# Altium project Smart Battery.PrjPcb (part 2 of 2)

## Sheet 3S 4S.SchDoc
size A3; SheetNumber: 6; SheetTotal: 8
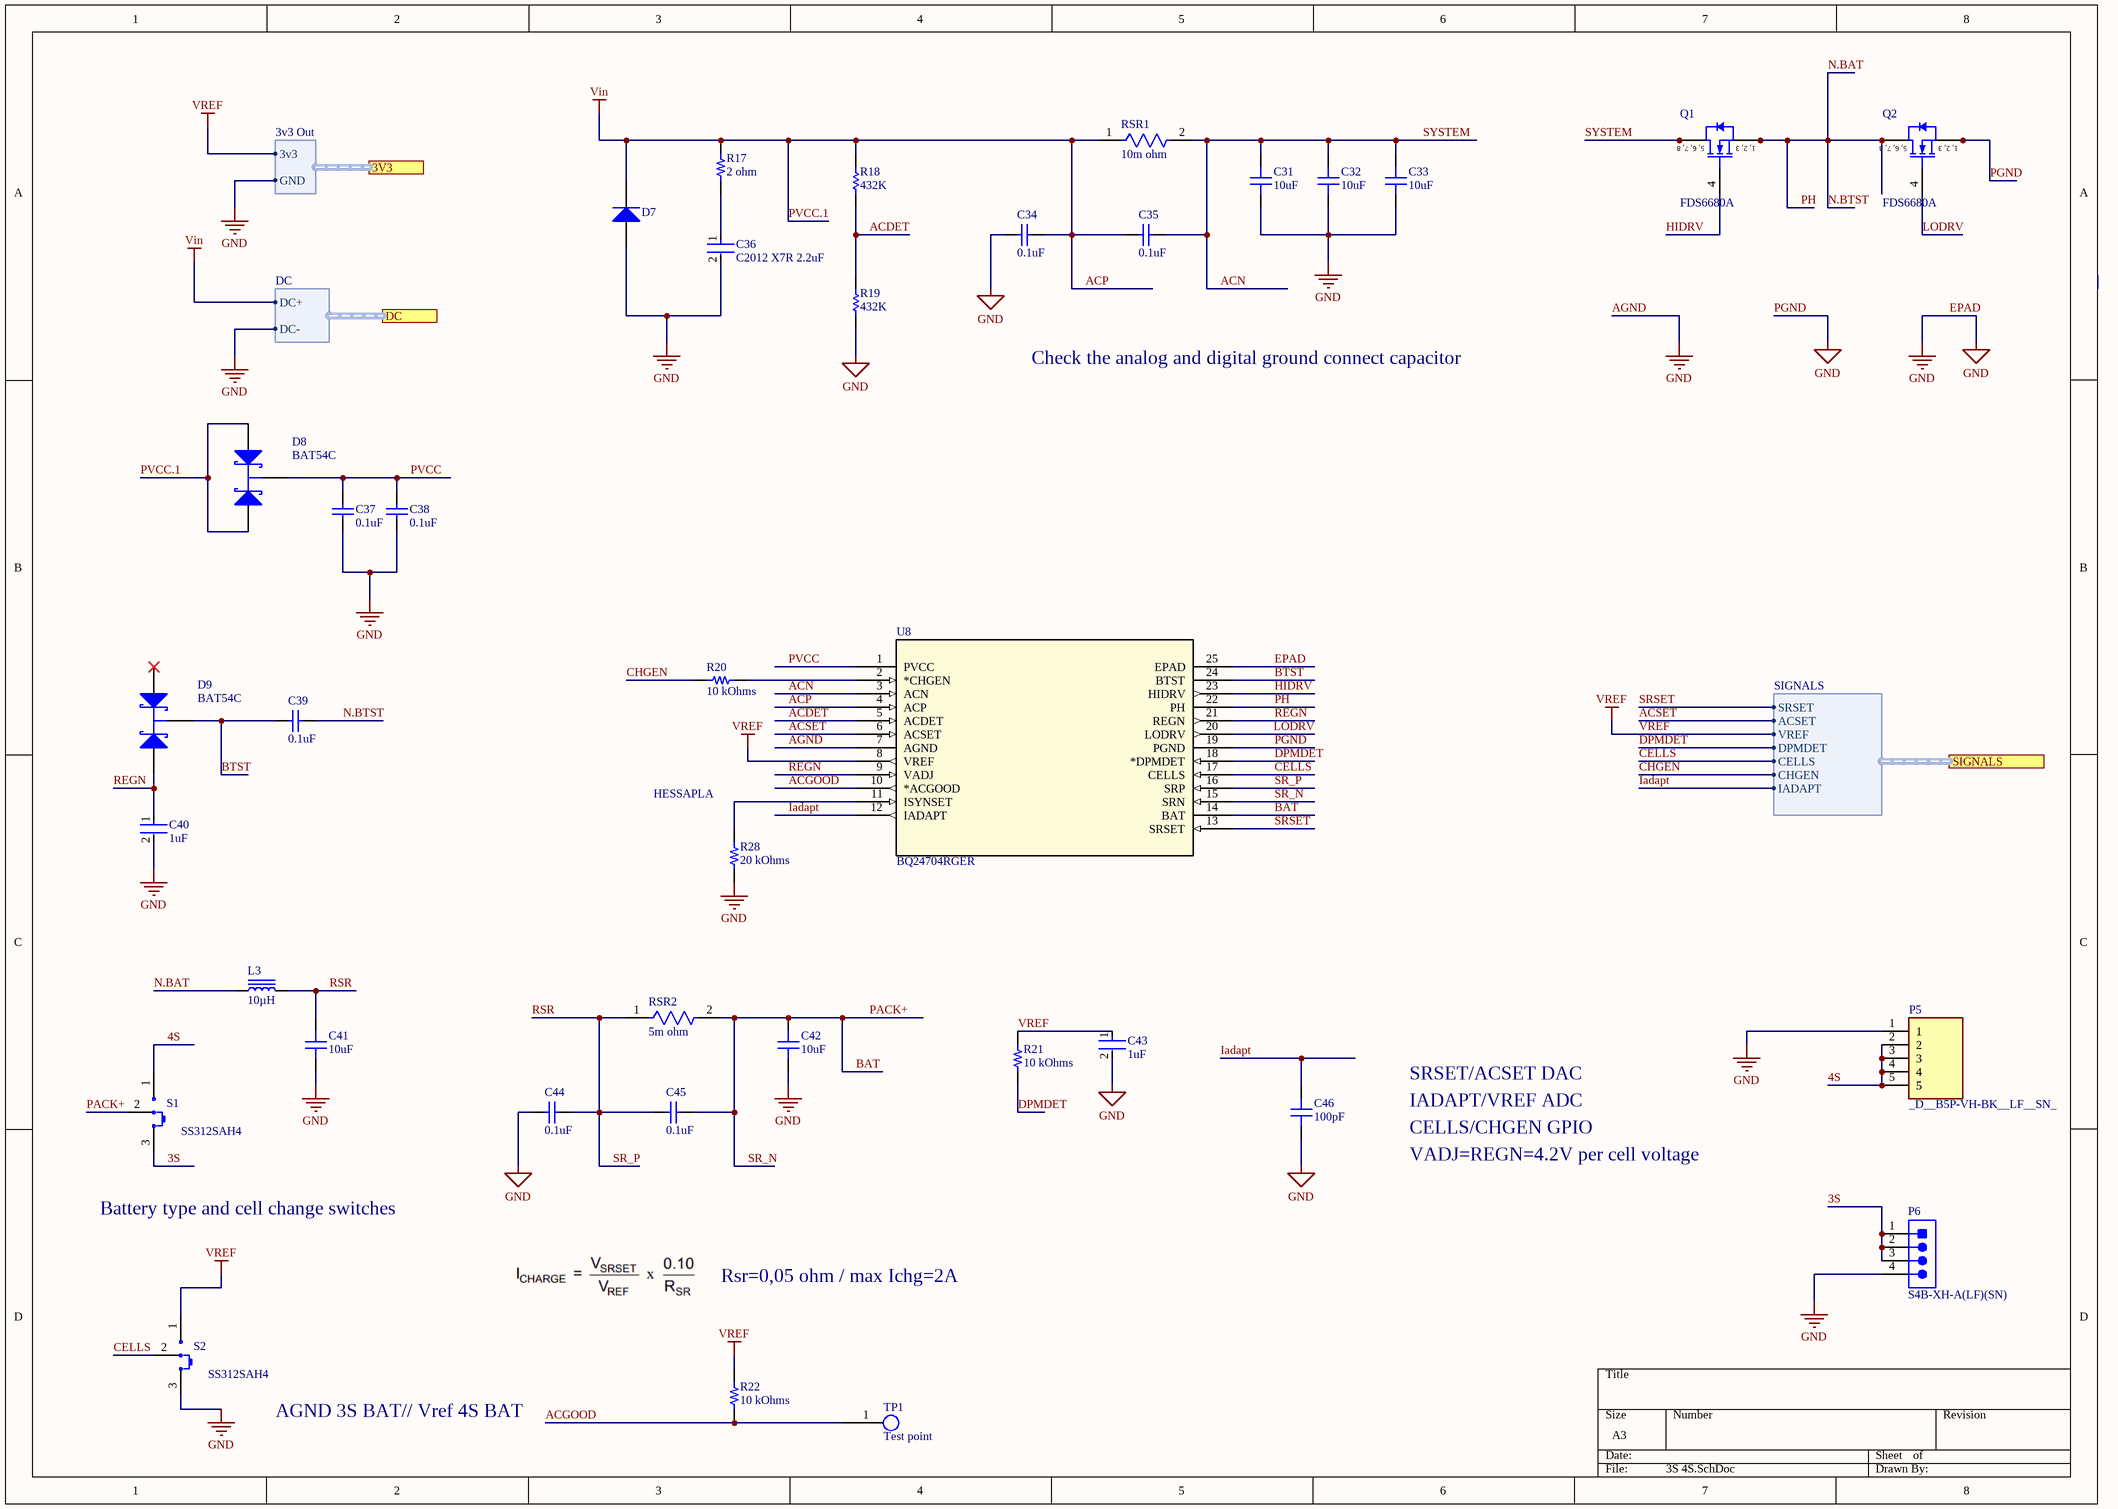
[diagram p5: 3S 4S.SchDoc]

### Parts
C31  10uF  [CAP 1206_3216 - 0.8MM]
C32  10uF  [CAP 1206_3216 - 0.8MM]
C33  10uF  [CAP 1206_3216 - 0.8MM]
C34  0.1uF  [CAPC2013X94X50NL20T25]
C35  0.1uF  [CAPC2013X94X50NL20T25]
C36  C2012 X7R 2.2uF  [FP-C2012-125-0_2-IPC_B]
C37  0.1uF  [CAPC2013X94X50NL20T25]
C38  0.1uF  [CAPC2013X94X50NL20T25]
C39  0.1uF  [CAPC2013X94X50NL20T25]
C40  1uF  [FP-C2012-125-0_2-IPC_B]
C41  10uF  [CAP 1206_3216 - 0.8MM]
C42  10uF  [CAP 1206_3216 - 0.8MM]
C43  1uF  [FP-C2012-125-0_2-IPC_B]
C44  0.1uF  [CAPC2013X94X50NL20T25]
C45  0.1uF  [CAPC2013X94X50NL20T25]
C46  100pF  [CAP 1206_3216 - 0.8MM]
D7  (no value)  [DIOD-SMA-2_A_V]
D8  BAT54C  [NXP-SOT23-3_V]
D9  BAT54C  [NXP-SOT23-3_V]
L3  10µH  [BOURNS SRP5030T]
P5  _D__B5P-VH-BK__LF__SN_  [SHDR5W114P0X396_1X5_1974X850X1090P]
P6  S4B-XH-A(LF)(SN)  [JST-S4B-XH-A(LF)(SN)_V]
Q1  FDS6680A  [FAIR-SOIC-8_V]
Q2  FDS6680A  [FAIR-SOIC-8_V]
R17  2 ohm  [RES 1210_3225]
R18  432K  [RESC1005X40X25NL05T10]
R19  432K  [RESC1005X40X25NL05T10]
R20  10 kOhms  [RES 0603_1608]
R21  10 kOhms  [RES 0603_1608]
R22  10 kOhms  [RES 0603_1608]
R28  20 kOhms  [RES 0603_1608]
RSR1  10m ohm  [FP-CSRN2010-IPC_A]
RSR2  5m ohm  [FP-CSRN2010-IPC_A]
S1  SS312SAH4  [NKK SS312SAH4]
S2  SS312SAH4  [NKK SS312SAH4]
TP1  Test point  [Test Point]
U8  BQ24704RGER  [RGE24_2P45X2P45]

### Ports
3V3 (harness 3v3 Out), DC (harness DC), SIGNALS (harness SIGNALS)

### Harnesses
SIGNALS: SRSET, ACSET, VREF, DPMDET, CELLS, CHGEN, IADAPT
3v3 Out: 3v3, GND
DC: DC+, DC-

### Nets
ACP: C34.2 C35.1 D7.2(K) D8.1(A) D8.2(A) R17.2 R18.2 RSR1.1 U8.4(ACP) ; port DC.DC+  [also labelled PVCC.1, Vin]
AGND: C31.1 C32.1 C33.1 C34.1 C36.2 C37.1 C38.1 C40.2 C41.1 C42.1 C43.2 C44.1 C46.1 D7.1(A) P5.1 P6.4 Q2.1(S) Q2.2(S) Q2.3(S) R19.1 R28.1 S2.3 U8.7(AGND) U8.19(PGND) U8.25(EPAD) ; port 3V3.GND, port DC.DC-  [also labelled EPAD, GND, PGND]
VREF: C43.1 R21.2 R22.2 S2.1 U8.8(VREF) ; port SIGNALS.VREF, port 3V3.3v3  [project net Power Input 3V3]
3S: P6.1 P6.2 P6.3 S1.3
4S: P5.2 P5.3 P5.4 P5.5 S1.1
ACDET: R18.1 R19.2 U8.5(ACDET)
ACGOOD: R22.1 TP1.1 U8.10(*ACGOOD)
ACN: C31.2 C32.2 C33.2 C35.2 Q1.5(D) Q1.6(D) Q1.7(D) Q1.8(D) RSR1.2 U8.3(ACN)  [also labelled SYSTEM]
ACSET: U8.6(ACSET) ; port SIGNALS.ACSET
BAT: C42.2 C45.2 RSR2.2 S1.2(COM) U8.14(BAT) U8.15(SRN)  [also labelled PACK+, SR_N]
BTST: C39.1 D9.3(K) U8.24(BTST)
CELLS: S2.2(COM) U8.17(CELLS) ; port SIGNALS.CELLS
CHGEN: R20.2 ; port SIGNALS.CHGEN
DPMDET: R21.1 U8.18(*DPMDET) ; port SIGNALS.DPMDET
HIDRV: Q1.4(G) U8.23(HIDRV)
IADAPT: C46.2 U8.12(IADAPT) ; port SIGNALS.IADAPT
LODRV: Q2.4(G) U8.20(LODRV)
N.BAT: C39.2 L3.1 Q1.1(S) Q1.2(S) Q1.3(S) Q2.5(D) Q2.6(D) Q2.7(D) Q2.8(D) U8.22(PH)  [also labelled N.BTST, PH]
PVCC: C37.2 C38.2 D8.3(K) U8.1(PVCC)
REGN: C40.1 D9.2(A) U8.9(VADJ) U8.21(REGN)
RSR: C41.2 C44.2 C45.1 L3.2 RSR2.1 U8.16(SRP)  [also labelled SR_P]
SRSET: U8.13(SRSET) ; port SIGNALS.SRSET
NetC36_1: C36.1 R17.1
NetR20_1: R20.1 U8.2(*CHGEN)
NetR28_2: R28.2 U8.11(ISYNSET)

Not connected (* = marked no-connect by the designer): D9 1(A)*

### Notes on the sheet
- Check the analog and digital ground connect capacitor
- (near R28) HESSAPLA
- SRSET/ACSET DAC
- IADAPT/VREF ADC
- CELLS/CHGEN GPIO
- VADJ=REGN=4.2V per cell voltage
- Battery type and cell change switches
- Rsr=0,05 ohm / max Ichg=2A
- AGND 3S BAT// Vref 4S BAT
- (in symbol CMP-2000-06259-1) 5, 6, 7, 8; 1, 2, 3

### Library data of the parts
C31-C33 C41 C42 = CC1206JRNPO0BN272: 10µF, 25V, 20%, X5R, 1206; Manufacturer: Yageo; Capacitance: 2700pF; Temperature Coefficient: C0G, NP0; Tolerance: ±5%; Voltage - Rated: 100V; Part Number: CC1206JRNPO0BN272; Value: 10uF; Applications: General Purpose; ComponentLink1Description: Datasheet; ComponentLink1URL: http://www.yageo.com/documents/recent/UPY-NP0X7R_MV_100-to-630V_21.pdf; ComponentLink2Description: DigiKey Link; ComponentLink2URL: http://digikey.com/product-detail/en/yageo/CC1206JRNPO0BN272/311-4396-1-ND/8025485; Device Package: 1206 (3216 Metric); LastUpdated: 2.09.2020 01:04:46; Lifecycle Status: Active; Minimum Order: 1; Mounting Type: Surface Mount, MLCC; Operating Temperature: -55°C ~ 125°C; Package / Case: 1206 (3216 Metric); Packaging: TapeAndReel; PartId: 18687; Part Status: Active; Price: 0.08; Series: CC; Size / Dimension: 0.126" L x 0.063" W (3.20mm x 1.60mm); Supplier 1: DigiKey; Supplier Part Number 1: 311-4396-1-ND; Thickness (Max): 0.028" (0.70mm)
C34 C35 C37-C39 C44 C45 = CMP-1036-04427-2: 0.1µF, 50V, 10%, X7R, 0805; Manufacturer: AVX Interconnect / Elco; Part Number: 08051C104JAT2A
C36 = CMP-2000-06040-2: Multilayer Ceramic Capacitors 2.2μF ±10% 50V X7R SMD 0805; Mount: Surface Mount; Dielectric Material: Ceramic; Height: 1.25mm; Radiation Hardening: No; Case/Package: 0805; Voltage: 50V; Min Operating Temperature: -55°C; Voltage Rating (DC): 50V; Lead Free: Lead Free; Length: 2mm; Dielectric: X7R; Package Quantity: 1; Contact Plating: Tin; RoHS Compliant: Yes; Series: C; Resistor Type: Ceramic; Voltage Rating: 50V; Case Code (Imperial): 0805; Thickness: 0.057inch; Packaging: Tape and Reel; Depth: 1.25mm; Max Operating Temperature: 125°C; Weight: 0.000194oz; Width: 0.049inch; Tolerance: 10%; Termination: SMD/SMT; Construction: Flat; Capacitance: 2.2uF; REACH SVHC: No SVHC; Case Code (Metric): 2012
C40 C43 = CMP-2000-05454-2: 1µF, 25V, 10%, X7R, 2012, TDK; Dielectric: X7S; Voltage Rating (DC): 100V; Case Code (Metric): 2012; Capacitance: 1uF; Width: 1.25mm; Mount: Surface Mount; Package Quantity: 1; RoHS Compliant: Yes; Case Code (Imperial): 0805; REACH SVHC: No SVHC; Resistor Type: Ceramic; Depth: 1.25mm; Thickness: 0.053inch; Case/Package: 0805; Lead Free: Lead Free; Length: 2mm; Series: C; Voltage: 100V; Height: 1.25mm; Min Operating Temperature: -55°C; Termination: SMD/SMT; Weight: 0.000194oz; Max Operating Temperature: 125°C; Number of Pins: 2; Tolerance: 10%; Packaging: Tape and Reel; Voltage Rating: 100V
C46 = CC1206JRNPO0BN272: 100pF, 25V, 10%, X7R, 0805,; Manufacturer: Yageo; Capacitance: 2700pF; Temperature Coefficient: C0G, NP0; Tolerance: ±5%; Voltage - Rated: 100V; Part Number: CC1206JRNPO0BN272; Value: 100pF; Applications: General Purpose; ComponentLink1Description: Datasheet; ComponentLink1URL: http://www.yageo.com/documents/recent/UPY-NP0X7R_MV_100-to-630V_21.pdf; ComponentLink2Description: DigiKey Link; ComponentLink2URL: http://digikey.com/product-detail/en/yageo/CC1206JRNPO0BN272/311-4396-1-ND/8025485; Device Package: 1206 (3216 Metric); LastUpdated: 2.09.2020 01:04:46; Lifecycle Status: Active; Minimum Order: 1; Mounting Type: Surface Mount, MLCC; Operating Temperature: -55°C ~ 125°C; Package / Case: 1206 (3216 Metric); Packaging: TapeAndReel; PartId: 18687; Part Status: Active; Price: 0.08; Series: CC; Size / Dimension: 0.126" L x 0.063" W (3.20mm x 1.60mm); Supplier 1: DigiKey; Supplier Part Number 1: 311-4396-1-ND; Thickness (Max): 0.028" (0.70mm)
D7 = CMP-2000-07364-1: Ultra-Fast Rectifier, 1 A, 1.7 V, -65 to 150 degC, 2-Pin SMA, RoHS, Tape and Reel; Manufacturer: Diodes Inc; Forward Voltage: 1.7V; Reverse Recovery Time-Max: 75ns; Average Rectified Current-Max: 1A; Reverse Current-Max: 5µA; Reverse Voltage-Max [Vrrm]: 1000V; Package Description: 2-Pin Surface Mount Device, Body 4.3 x 2.605 mm; Datasheet URL: http://www.diodes.com/_files/datasheets/ds16008.pdf; Datasheet Version: Rev. 11-2, 12/2014; Package Reference: SMA-2; Mounting Technology: SurfaceMount; Manufacturer URL: http://www.diodes.com/
D8 D9 = CMP-0417-00003-1: Schottky Barrier Diode, 30 V, 2 uA, -55 to 150 degC, 3-Pin SOT23, RoHS, Tape and Reel; Manufacturer: NXP Semiconductors; IR (uA): 2; VF (mV): 800; Trr (ns): 5; Cd (pF): 10; VR (V): 30; Rth(j-a) (K/W): 500; RoHS: TRUE; Packing: Tape and Reel; ComponentLink2URL: http://www.nxp.com/documents/data_sheet/BAT54_SER.pdf; PartNumber: BAT54C; ComponentLink2Description: Datasheet; Temperature Range: -55 to 150 degC; PackageReference: SOT23-3; PackageDescription: 3-Pin Plastic Surface-mounted Package, Body 1.3 x 2.9 mm, Pitch 0.95 mm; Mounting Technology: Surface Mount; ComponentLink1URL: http://www.nxp.com/; DatasheetVersion: Rev. 5; ComponentLink1Description: Manufacturer URL
L3 = SRP5030T-100M: FIXED IND 10UH 2.75A 128MOHM SMD; Manufacturer: Bourns Inc.; Current - Saturation: 3.5A; DC Resistance (DCR): 128mOhm Max; Inductance Frequency - Test: 100kHz; Material - Core: Iron Powder; Shielding: Shielded; Tolerance: ±20%; Type: Wirewound; Part Number: SRP5030T-100M; ComponentLink1Description: Datasheet; ComponentLink1URL: https://www.bourns.com/docs/Product-Datasheets/SRP5030T.pdf; ComponentLink2Description: DigiKey Link; ComponentLink2URL: http://digikey.com/product-detail/en/bourns-inc/SRP5030T-100M/SRP5030T-100MCT-ND/3986029; Current Rating (Amps): 2.75A; Device Package: Nonstandard; Height - Seated (Max): 0.118" (3.00mm); Inductance: 10µH; LastUpdated: 2.09.2020 01:22:09; Lifecycle Status: Active; Minimum Order: 1; Mounting Type: Surface Mount; Operating Temperature: -40°C ~ 125°C; Package / Case: Nonstandard; Packaging: TapeAndReel; PartId: 9; Part Status: Active; Price: 0.66; Series: SRP5030T; Size / Dimension: 0.224" L x 0.205" W (5.70mm x 5.20mm); Supplier 1: DigiKey; Supplier Part Number 1: SRP5030T-100MCT-ND; Value: 10µH
P5 = _D__B5P-VH-BK__LF__SN_: Connector; Manufacturer_Name: JST (JAPAN SOLDERLESS TERMINALS); Manufacturer_Part_Number: (D) B5P-VH-BK (LF)(SN); Datasheet Link: https://www.jst-mfg.com/product/pdf/eng/eVH.pdf; Height: 10.9mm; Mouser Part Number: N/A; Mouser Price/Stock: https://www.mouser.co.uk/ProductDetail/JST/D-B5P-VH-BK-LFSN?qs=wnTfsH77Xs6D1q6ZybO7cA%3D%3D
P6 = CMP-1755-00007-1: Male Header, Pitch 2.5 mm, 1 x 4 Position, Height 6.1 mm, Tail Length 3.4 mm, -25 to 85 degC, RoHS, Bulk; PackageReference: S4B-XH-A(LF)(SN); ComponentLink1Description: Manufacturer URL; DatasheetVersion: May-16; ComponentLink2Description: Datasheet; ComponentLink2URL: http://www.jst-mfg.com/product/pdf/eng/eXH.pdf; ComponentLink1URL: http://www.jst.com/home2.html; PackageDescription: Male Header, Pitch 2.5 mm, 1 x 4 Position, Height 6.1 mm, Tail Length 3.4 mm
Q1 Q2 = CMP-2000-06259-1: Single N-Channel, Logic Level, Power Trench(R) MOSFET, 30 V, 12.5 A, -55 to 150 degC, 8-Pin SOIC, RoHS, Tape and Reel; Manufacturer: Fairchild Semiconductor; Drain-to-Source Voltage [Vdss]: 30V; Drain-Source On Resistance-Max: 9.5mO; Rated Power Dissipation: 1W; Qg Gate Charge: 23nC; Package Description: 8-Pin Small Outline Integrated Circuit, Body 4.9 x 3.9 mm, Pitch 1.27 mm; Channel Type: N-Channel; Package Reference: SOIC-8; Datasheet Version: Rev. F2(W), 07/2012; Package URL: https://www.fairchildsemi.com/package-drawings/M0/M08A.pdf; Mounting Technology: SurfaceMount; Manufacturer URL: https://www.fairchildsemi.com/; Datasheet URL: https://www.fairchildsemi.com/datasheets/FD/FDS6680A.pdf
R17 = RK73B2ETTD332J: RES 3.3K OHM 5% 1/2W 1210; Manufacturer: KOA Speer Electronics, Inc.; Power (Watts): 0.5W, 1/2W; Resistance: 3.3 kOhms; Temperature Coefficient: ±200ppm/°C; Value: 3.3 kOhms; Part Number: RK73B2ETTD332J; ComponentLink1Description: Datasheet; ComponentLink1URL: http://www.koaspeer.com/catimages/Products/RK73B/RK73B.pdf; ComponentLink2Description: DigiKey Link; ComponentLink2URL: http://digikey.com/product-detail/en/koa-speer-electronics-inc/RK73B2ETTD332J/2019-RK73B2ETTD332JCT-ND/10315047; Composition: Thick Film; Device Package: 1210 (3225 Metric); Features: Automotive AEC-Q200, Moisture Resistant; LastUpdated: 2.09.2020 01:26:16; Lifecycle Status: Active; Minimum Order: 1; Number of Terminations: 2; Operating Temperature: -55°C ~ 155°C; Package / Case: 1210 (3225 Metric); Packaging: TapeAndReel; Part Status: Active; Price: 0.02; Ratings: AEC-Q200; Series: RK73B; Supplier 1: DigiKey; Supplier Part Number 1: 2019-RK73B2ETTD332JCT-ND; Supplier Device Package: 1210; Tolerance: ±5%
R18 R19 = CMP-1011-00001-2: 432K,1/16W, %1; Manufacturer: Yageo / Phycomp; Part Number: RC0402JR-070RL
R20-R22 = RNCS0603BKE10K0: RES 10K OHM 0.1% 1/16W 0603; Manufacturer: Stackpole Electronics Inc; Power (Watts): 0.063W, 1/16W; Temperature Coefficient: ±25ppm/°C; Part Number: RNCS0603BKE10K0; Value: 10 kOhms; ComponentLink1Description: Datasheet; ComponentLink1URL: https://www.seielect.com/catalog/sei-rncs_rnch.pdf; ComponentLink2Description: DigiKey Link; ComponentLink2URL: http://digikey.com/product-detail/en/stackpole-electronics-inc/RNCS0603BKE10K0/RNCS0603BKE10K0CT-ND/1800113; Composition: Thin Film; Device Package: 0603 (1608 Metric); Features: Anti-Corrosive, Automotive AEC-Q200, Moisture Resistant; Height - Seated (Max): 0.022" (0.55mm); LastUpdated: 2.09.2020 01:10:25; Lifecycle Status: Active; Minimum Order: 1; Number of Terminations: 2; Operating Temperature: -55°C ~ 155°C; Package / Case: 0603 (1608 Metric); Packaging: TapeAndReel; PartId: 4838; Part Status: Active; Price: 0.08; Ratings: AEC-Q200; Resistance: 10 kOhms; Series: RNCS; Size / Dimension: 0.061" L x 0.031" W (1.55mm x 0.80mm); Supplier 1: DigiKey; Supplier Part Number 1: RNCS0603BKE10K0CT-ND; Supplier Device Package: 0603; Tolerance: ±0.1%
R28 = RNCS0603BKE10K0: RES 10K OHM 0.1% 1/16W 0603; Manufacturer: Stackpole Electronics Inc; Power (Watts): 0.063W, 1/16W; Resistance: 10 kOhms; Temperature Coefficient: ±25ppm/°C; Part Number: RNCS0603BKE10K0; Value: 20 kOhms; ComponentLink1Description: Datasheet; ComponentLink1URL: https://www.seielect.com/catalog/sei-rncs_rnch.pdf; ComponentLink2Description: DigiKey Link; ComponentLink2URL: http://digikey.com/product-detail/en/stackpole-electronics-inc/RNCS0603BKE10K0/RNCS0603BKE10K0CT-ND/1800113; Composition: Thin Film; Device Package: 0603 (1608 Metric); Features: Anti-Corrosive, Automotive AEC-Q200, Moisture Resistant; Height - Seated (Max): 0.022" (0.55mm); LastUpdated: 2.09.2020 01:10:25; Lifecycle Status: Active; Minimum Order: 1; Number of Terminations: 2; Operating Temperature: -55°C ~ 155°C; Package / Case: 0603 (1608 Metric); Packaging: TapeAndReel; PartId: 4838; Part Status: Active; Price: 0.08; Ratings: AEC-Q200; Series: RNCS; Size / Dimension: 0.061" L x 0.031" W (1.55mm x 0.80mm); Supplier 1: DigiKey; Supplier Part Number 1: RNCS0603BKE10K0CT-ND; Supplier Device Package: 0603; Tolerance: ±0.1%
RSR1 = CMP-26527-000090-1: RES 0.01 OHM 1% 1W 2010; Temperature Coefficient: 250ppm/°C; Resistance: 10mR; Packaging: Tape and Reel; Lead Free: Lead Free; Contact Plating: Tin; Case Code (Metric): 5025; Case/Package: 2010; Radiation Hardening: No; Power Rating: 1W; RoHS Compliant: Yes; Length: 0.197inch; Mount: Surface Mount; Max Operating Temperature: 155°C; Case Code (Imperial): 2010; Series: CSRN; Min Operating Temperature: -55°C; Width: 0.097inch; Resistor Type: Thick Film; Number of Terminations: 2; Tolerance: 1%; Max Power Dissipation: 1W; Height: 0.03inch
RSR2 = CMP-26527-000090-1: RES 0.01 OHM 1% 1W 2010 / https://www.ozdisan.com/pasif-komponentler/direncler/hassas-ve-sont-direncler/CFG0612-FX-R005ELF; Temperature Coefficient: 250ppm/°C; Resistance: 10mR; Packaging: Tape and Reel; Lead Free: Lead Free; Contact Plating: Tin; Case Code (Metric): 5025; Case/Package: 2010; Radiation Hardening: No; Power Rating: 1W; RoHS Compliant: Yes; Length: 0.197inch; Mount: Surface Mount; Max Operating Temperature: 155°C; Case Code (Imperial): 2010; Series: CSRN; Min Operating Temperature: -55°C; Width: 0.097inch; Resistor Type: Thick Film; Number of Terminations: 2; Tolerance: 1%; Max Power Dissipation: 1W; Height: 0.03inch
S1 S2 = SS312SAH4: SWITCH SLIDE SPDT 0.4VA 28V; Manufacturer: NKK Switches; Actuator Length: 2.00mm; Actuator Type: Standard; Contact Timing: Shorting (MBB); Current Rating (Amps): 0.4VA (AC/DC); Switch Function: On-On; Part Number: SS312SAH4; Circuit: SPDT; ComponentLink1Description: Datasheet; ComponentLink1URL: http://www.nkkswitches.com/pdf/SS3surfaceMount-1.pdf; ComponentLink2Description: DigiKey Link; ComponentLink2URL: http://digikey.com/product-detail/en/nkk-switches/SS312SAH4/360-3250-ND/1052031; Contact Finish: Gold; Contact Material: Phosphor Bronze; LastUpdated: 4.01.2020 19:15:23; Lifecycle Status: Active; Minimum Order: 1; Mounting Type: Surface Mount, Right Angle; Operating Temperature: -25°C ~ 85°C; Packaging: Tray; PartId: 2; Part Status: Active; Price: 3.02; Series: SS3; Supplier 1: DigiKey; Supplier Part Number 1: 360-3250-ND; Termination Style: Gull Wing; Voltage Rating - AC: 28V; Voltage Rating - DC: 28V
U8 = BQ24704RGER: Unknown; Manufacturer: Texas Instruments; PIN_COUNT: 24; PACKAGE_DESIGNATOR: RGE; Datasheet_URL: Unknown; INDUSTRY_STD_PKG_TYPE: Unknown; FAMILY_NAME: Unknown; GENERIC_PART_NUMBER: BQ24704; Copyright: Copyright (C) 2021 Accelerated Designs. All rights reserved; RefDes: RefDes; Type: DEV

## Sheet ADJ Power managment.SchDoc
size A4; SheetNumber: 8; SheetTotal: 8
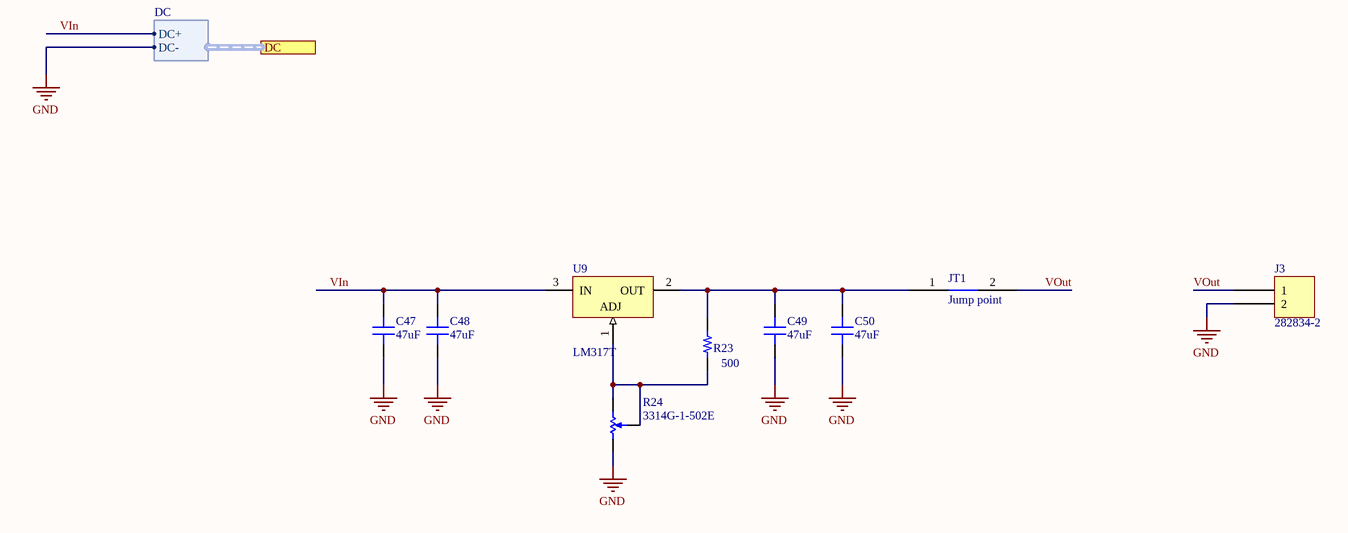
[diagram p6: ADJ Power managment.SchDoc]

### Parts
C47  47uF  [CAP 0805_2012]
C48  47uF  [CAP 0805_2012]
C49  47uF  [CAP 0805_2012]
C50  47uF  [CAP 0805_2012]
J3  282834-2  [TE 282834-2]
JT1  Jump point  [jump poınt]
R23  500  [RES 0805_2012]
R24  3314G-1-502E  [BOUR-3314G-1_V]
U9  LM317T  [NDE0003A]

### Ports
DC (harness DC)

### Harnesses
DC: DC+, DC-

### Nets
GND: C47.1 C48.1 C49.1 C50.1 J3.2 R24.1 ; port DC.DC-  [project net AGND]
VIn: C47.2 C48.2 U9.3(IN) ; port DC.DC+  [project net ACP]
VOut: J3.1 JT1.2
NetC49_2: C49.2 C50.2 JT1.1 R23.2 U9.2(OUT)
NetR23_1: R23.1 R24.2 R24.3 U9.1(ADJ)

### Library data of the parts
C47-C50 = CBR08C330JAGAC: CAP CER 33PF 250V C0G/NP0 0805; Manufacturer: KEMET; Temperature Coefficient: C0G, NP0; Tolerance: ±5%; Part Number: CBR08C330JAGAC; Value: 47uF; Applications: RF, Microwave, High Frequency; Capacitance: 33pF; ComponentLink1Description: Datasheet; ComponentLink1URL: https://api.kemet.com/component-edge/download/datasheet/CBR08C330JAGAC.pdf; ComponentLink2Description: DigiKey Link; ComponentLink2URL: http://digikey.com/product-detail/en/kemet/CBR08C330JAGAC/399-6202-1-ND/2732182; Device Package: 0805 (2012 Metric); Features: High Q, Low Loss, Ultra Low ESR; LastUpdated: 2.09.2020 01:04:42; Lifecycle Status: Active; Minimum Order: 1; Mounting Type: Surface Mount, MLCC; Operating Temperature: -55°C ~ 125°C; Package / Case: 0805 (2012 Metric); Packaging: TapeAndReel; PartId: 2409; Part Status: Active; Price: 0.44; Series: CBR-SMD RF C0G; Size / Dimension: 0.079" L x 0.049" W (2.00mm x 1.25mm); Supplier 1: DigiKey; Supplier Part Number 1: 399-6202-1-ND; Thickness (Max): 0.035" (0.88mm); Voltage - Rated: 250V
J3 = 282834-2: TERM BLK 2P SIDE ENT 2.54MM PCB; Manufacturer: TE Connectivity AMP Connectors; Current: 10A; Mating Orientation: Horizontal with Board; Number of Levels: 1; Pitch: 0.100" (2.54mm); Positions Per Level: 2; Voltage: 150V; Wire Gauge: 16-30 AWG; Wire Termination: Screw - Rising Cage Clamp; Part Number: 282834-2; Color: Green; ComponentLink1Description: Datasheet; ComponentLink1URL: https://www.te.com/commerce/DocumentDelivery/DDEController?Action=srchrtrv&DocNm=282834&DocType=Customer+Drawing&DocLang=English; ComponentLink2Description: DigiKey Link; ComponentLink2URL: http://digikey.com/product-detail/en/te-connectivity-amp-connectors/282834-2/A98333-ND/1150135; LastUpdated: 15.01.2020 04:15:38; Lifecycle Status: Active; Minimum Order: 1; Mounting Type: Through Hole; Packaging: Bulk; Part Status: Active; Price: 0.88; Series: Buchanan; Supplier 1: DigiKey; Supplier Part Number 1: A98333-ND
R23 = TLRZ2ATTD: RES 500 OHM JUMPER 0805; Manufacturer: KOA Speer Electronics, Inc.; Part Number: TLRZ2ATTD; ComponentLink1Description: Datasheet; ComponentLink1URL: http://www.koaspeer.com/catimages/Products/TLRZ/TLRZ.pdf; ComponentLink2Description: DigiKey Link; ComponentLink2URL: http://digikey.com/product-detail/en/koa-speer-electronics-inc/TLRZ2ATTD/2019-TLRZ2ATTDCT-ND/9847538; Composition: Metal Element; Device Package: 0805 (2012 Metric); Features: Automotive AEC-Q200, Current Sense; Height - Seated (Max): 0.022" (0.55mm); LastUpdated: 2.09.2020 01:15:24; Lifecycle Status: Active; Minimum Order: 1; Number of Terminations: 2; Operating Temperature: -55°C ~ 170°C; Package / Case: 0805 (2012 Metric); Packaging: TapeAndReel; PartId: 27685; Part Status: Active; Price: 0.09; Ratings: AEC-Q200; Series: TLRZ; Size / Dimension: 0.079" L x 0.049" W (2.00mm x 1.25mm); Supplier 1: DigiKey; Supplier Part Number 1: 2019-TLRZ2ATTDCT-ND; Supplier Device Package: 0805; Tolerance: Jumper
R24 = CMP-2000-05589-1: 4 mm Square Trimpot(R) Trimming Potentiometer, 5 KOhm, +/- 20%, 0.25 W, -55 to 125 degC, 3-Pin SMD, RoHS, Tape and Reel; Manufacturer: Bourns; Power: 250; Angle of rotation: 240°; Dielectric strength: 500; Resistance: 5; Curve: linear; Package Description: 3-Pin Surface Mount Device, Body 4.5 x 4.5 mm, Pitch 1.15 mm; Package Reference: 3314G-1; Mounting Technology: SurfaceMount; Datasheet URL: http://www.bourns.com/docs/Product-Datasheets/3314.pdf; Datasheet Version: 05/2016; Tolerance: ±20%; Manufacturer URL: http://www.bourns.com/; Temperature range: -55...+125°C; Package: GullWing
U9 = CMP-0062-02456-3: 3-Terminal Adjustable Regulator, 3-pin TO-220; Manufacturer: Texas Instruments; CompType: LDO IC; PowerWise: N; PackageTopMarking: NSUZXYTTE#*LM317T P+; ComponentLink1Description: Datasheet URL; PackageReference: NDE0003A; PinCount: 3; ComponentLink1URL: http://www.ti.com/general/docs/lit/getliterature.tsp?genericPartNumber=LM317-N&fileType=pdf; RoHS: N; PackageDescription: TO-220, Molded, 3 Lead, Straight

## Sheet Input Power.SchDoc
size A4; SheetNumber: 7; SheetTotal: 8
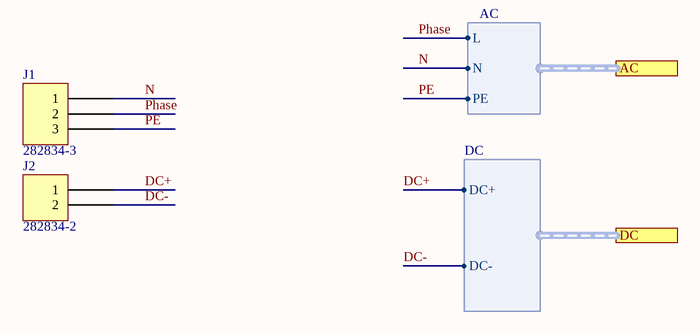
[diagram p7: Input Power.SchDoc]

### Parts
J1  282834-3  [TE 282834-3]
J2  282834-2  [TE 282834-2]

### Ports
AC (harness AC), DC (harness DC)

### Harnesses
DC: DC+, DC-
AC: L, N, PE

### Nets
DC+: J2.1 ; port DC.DC+  [project net ACP]
DC-: J2.2 ; port DC.DC-  [project net AGND]
N: J1.1 ; port AC.N
PE: J1.3 ; port AC.PE
Phase: J1.2 ; port AC.L

### Library data of the parts
J1 = 282834-3: TERM BLK 3P SIDE ENT 2.54MM PCB; Manufacturer: TE Connectivity AMP Connectors; Current: 10A; Mating Orientation: Horizontal with Board; Number of Levels: 1; Pitch: 0.100" (2.54mm); Positions Per Level: 3; Voltage: 150V; Wire Gauge: 16-30 AWG; Wire Termination: Screw - Rising Cage Clamp; Part Number: 282834-3; Color: Green; ComponentLink1Description: Datasheet; ComponentLink1URL: https://www.te.com/commerce/DocumentDelivery/DDEController?Action=srchrtrv&DocNm=282834&DocType=Customer+Drawing&DocLang=English; ComponentLink2Description: DigiKey Link; ComponentLink2URL: http://digikey.com/product-detail/en/te-connectivity-amp-connectors/282834-3/A98334-ND/1153264; LastUpdated: 15.01.2020 04:15:50; Lifecycle Status: Active; Minimum Order: 1; Mounting Type: Through Hole; Packaging: Bulk; Part Status: Active; Price: 2.01; Series: Buchanan; Supplier 1: DigiKey; Supplier Part Number 1: A98334-ND
J2 = 282834-2: as J3 on sheet ADJ Power managment; Part Number: 282834-2; Color: Green; ComponentLink1Description: Datasheet; ComponentLink1URL: https://www.te.com/commerce/DocumentDelivery/DDEController?Action=srchrtrv&DocNm=282834&DocType=Customer+Drawing&DocLang=English; ComponentLink2Description: DigiKey Link; ComponentLink2URL: http://digikey.com/product-detail/en/te-connectivity-amp-connectors/282834-2/A98333-ND/1150135; LastUpdated: 15.01.2020 04:15:38; Lifecycle Status: Active; Minimum Order: 1; Mounting Type: Through Hole; Packaging: Bulk; Part Status: Active; Price: 0.88; Series: Buchanan; Supplier 1: DigiKey; Supplier Part Number 1: A98333-ND

## Nets that join several sheets
+5V: AC DC (C27.1 L4.2 U10.4), 1S 2S (7 pins), MCU Power (S8.3)
ACP: MCU Power (6 pins), 3S 4S (9 pins), ADJ Power managment (C47.2 C48.2 U9.3), Input Power (J2.1)
AGND: AC DC (23 pins), 1S 2S (18 pins), MCU Power (8 pins), MCU (18 pins), 3S 4S (25 pins), ADJ Power managment (6 pins), Input Power (J2.2)
N: AC DC (F1.1 R2.1), Input Power (J1.1)
PE: AC DC (C1.1 C4.2), Input Power (J1.3)
Phase: AC DC (R1.1 R2.2), Input Power (J1.2)
Power Input 3V3: 1S 2S (6 pins), MCU Power (C17.2 C18.2 L2.2 R11.1), MCU (13 pins), 3S 4S (5 pins)
2S_C1: 1S 2S (U6.2), MCU (MCU.27)
2S_C2: 1S 2S (U7.2), MCU (MCU.28)
ACSET: MCU (MCU.10), 3S 4S (U8.6)
BAT1: 1S 2S (U5.2), MCU (MCU.29)
C_BAT1: 1S 2S (U5.5), MCU (MCU.30)
C_BAT2: 1S 2S (U6.5 U7.5), MCU (MCU.31)
CELLS: MCU (MCU.7), 3S 4S (S2.2 U8.17)
CHGEN: MCU (MCU.6), 3S 4S (R20.2)
CS1: 1S 2S (IC1.4), MCU (MCU.24)
CS2: 1S 2S (IC2.4), MCU (MCU.26)
DPMDET: MCU (MCU.12), 3S 4S (R21.1 U8.18)
IADAPT: MCU (MCU.8), 3S 4S (C46.2 U8.12)
SRSET: MCU (MCU.11), 3S 4S (U8.13)
U/D1: 1S 2S (IC1.3), MCU (MCU.16)
U/D2: 1S 2S (IC2.3), MCU (MCU.23)